# Altium schematic sheet controller.SchDoc
size A3; SheetNumber: 4; SheetTotal: 5
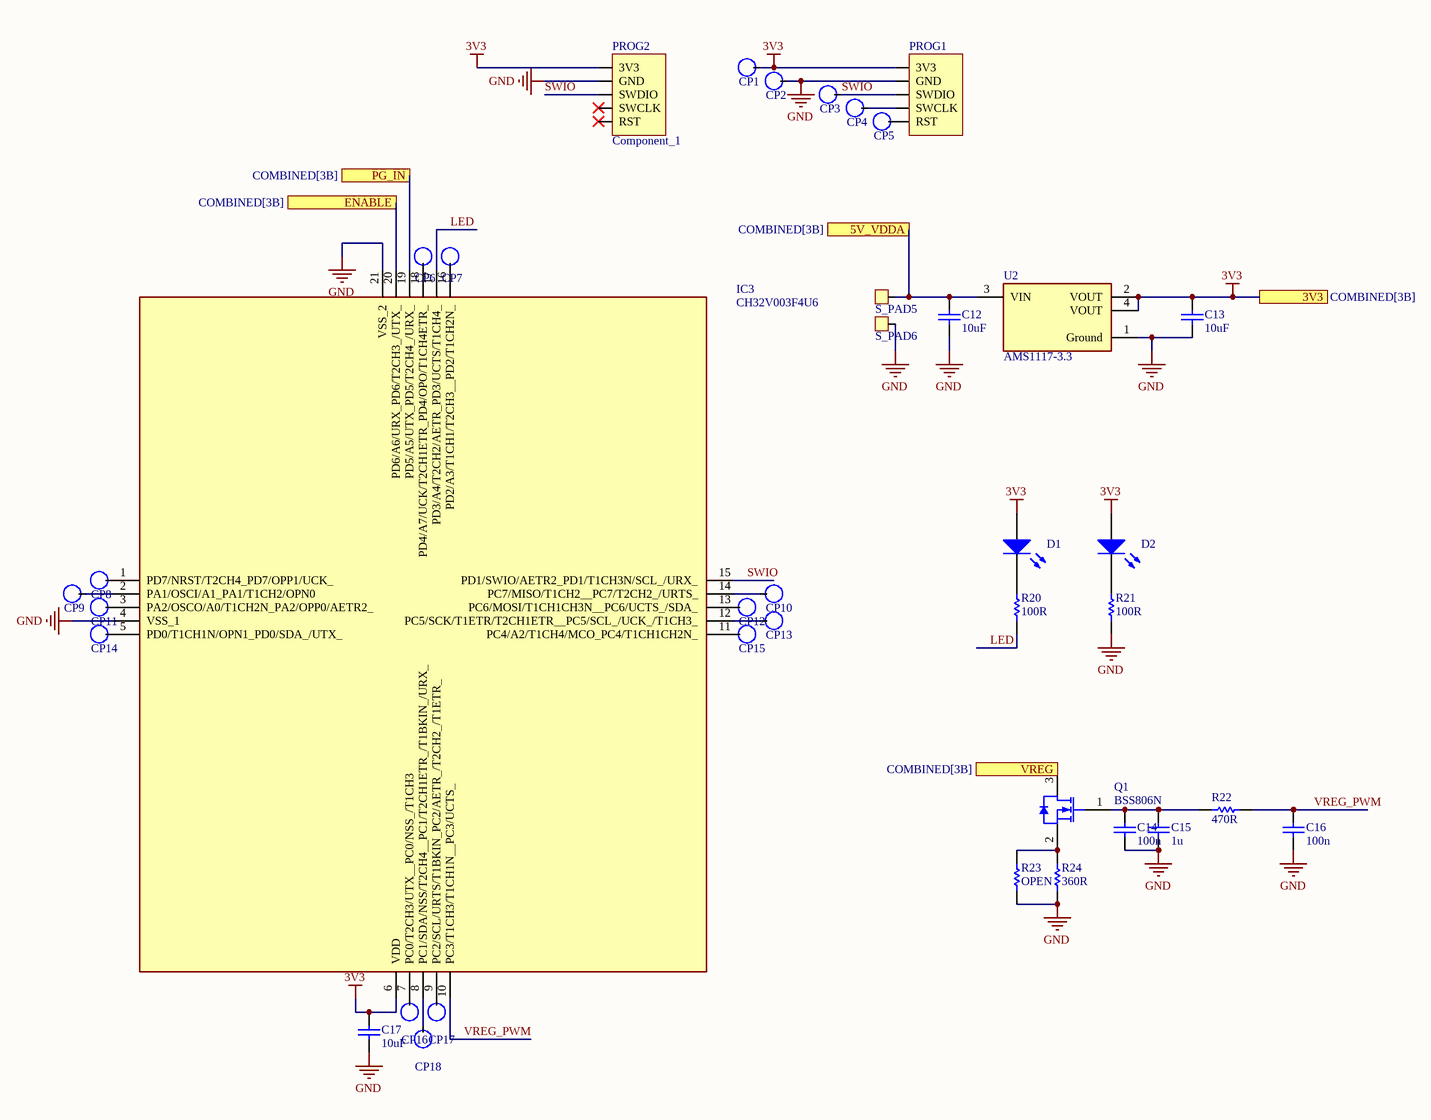
[diagram p0: controller.SchDoc]

## Parts
C12  value 10uF  [SMD-0603-RES]  (hidden comment: Capacitor)
C13  value 10uF  [SMD-0603-RES]  (hidden comment: Capacitor)
C14  value 100n  [CAP FILM 0603_1608]  (hidden comment: Capacitor)
C15  value 1u  [CAP FILM 0603_1608]  (hidden comment: Capacitor)
C16  value 100n  [CAP FILM 0603_1608]  (hidden comment: Capacitor)
C17  value 10uF  [SMD-0603-RES]  (hidden comment: Capacitor)
CP1  CONNECT_PAD  [PAD_SQUARE]  (value not drawn)
CP2  CONNECT_PAD  [PAD_SQUARE]  (value not drawn)
CP3  CONNECT_PAD  [PAD_SQUARE]  (value not drawn)
CP4  CONNECT_PAD  [PAD_SQUARE]  (value not drawn)
CP5  CONNECT_PAD  [PAD_SQUARE]  (value not drawn)
CP6  CONNECT_PAD  [PAD_SQUARE]  (value not drawn)
CP7  CONNECT_PAD  [PAD_SQUARE]  (value not drawn)
CP8  CONNECT_PAD  [PAD_SQUARE]  (value not drawn)
CP9  CONNECT_PAD  [PAD_SQUARE]  (value not drawn)
CP10  CONNECT_PAD  [PAD_SQUARE]  (value not drawn)
CP11  CONNECT_PAD  [PAD_SQUARE]  (value not drawn)
CP12  CONNECT_PAD  [PAD_SQUARE]  (value not drawn)
CP13  CONNECT_PAD  [PAD_SQUARE]  (value not drawn)
CP14  CONNECT_PAD  [PAD_SQUARE]  (value not drawn)
CP15  CONNECT_PAD  [PAD_SQUARE]  (value not drawn)
CP16  CONNECT_PAD  [PAD_SQUARE]  (value not drawn)
CP17  CONNECT_PAD  [PAD_SQUARE]  (value not drawn)
CP18  CONNECT_PAD  [PAD_SQUARE]  (value not drawn)
D1  Light-Emitting Diode  [SMD-0603-RES]  (value not drawn)
D2  Light-Emitting Diode  [SMD-0603-RES]  (value not drawn)
IC3  CH32V003F4U6  [QFN40P300X300X80-21N-D]
PROG1  Component_1  [programming_pad]  (value not drawn)
PROG2  Component_1  [programming_pad]
Q1  BSS806N  [INF-PG-SOT23_N]
R20  value 100R  [SMD-0603-RES]  (hidden comment: Resistor)
R21  value 100R  [SMD-0603-RES]  (hidden comment: Resistor)
R22  value 470R  [RES 0603_1608]  (hidden comment: Resistor)
R23  value OPEN  [RES 0603_1608]  (hidden comment: Resistor)
R24  value 360R  [RES 0603_1608]  (hidden comment: Resistor)
S_PAD5  SOLDER_PAD  [PAD_SQUARE]  (value not drawn)
S_PAD6  SOLDER_PAD  [PAD_SQUARE]  (value not drawn)
U2  AMS1117-3.3  [FP-AMS1117-IPC_C]

## Ports
3V3 (see COMBINED[3B]), 5V_VDDA (see COMBINED[3B]), ENABLE (see COMBINED[3B]), PG_IN (see COMBINED[3B]), VREG (see COMBINED[3B])

## Nets
3V3: C13.2 C17.2 CP1.1 D1.1(A) D2.1(A) IC3.6(VDD) PROG1.1(3V3) PROG2.1(3V3) U2.2(VOUT) U2.4(VOUT) ; port 3V3
GND: C12.1 C13.1 C14.1 C15.1 C16.1 C17.1 CP2.1 IC3.4(VSS_1) IC3.21(VSS_2) PROG1.2(GND) PROG2.2(GND) R21.1 R23.1 R24.1 S_PAD6.1 U2.1(Ground)
5V_VDDA: C12.2 S_PAD5.1 U2.3(VIN) ; port 5V_VDDA
ENABLE: IC3.20(PD6/A6/URX_PD6/T2CH3_/UTX_) ; port ENABLE
LED: IC3.17(PD3/A4/T2CH2/AETR_PD3/UCTS/T1CH4_) R20.1
PG_IN: IC3.19(PD5/A5/UTX_PD5/T2CH4_/URX_) ; port PG_IN
SWIO: CP3.1 IC3.15(PD1/SWIO/AETR2_PD1/T1CH3N/SCL_/URX_) PROG1.4(SWDIO) PROG2.4(SWDIO)
VREG: Q1.3(DRAIN) ; port VREG
VREG_PWM: C16.2 IC3.10(PC3/T1CH3/T1CH1N__PC3/UCTS_) R22.2
NetC14_2: C14.2 C15.2 Q1.1(GATE) R22.1
NetCP4_1: CP4.1 PROG1.3(SWCLK)
NetCP5_1: CP5.1 PROG1.5(RST)
NetCP6_1: CP6.1 IC3.18(PD4/A7/UCK/T2CH1ETR_PD4/OPO/T1CH4ETR_)
NetCP7_1: CP7.1 IC3.16(PD2/A3/T1CH1/T2CH3__PD2/T1CH2N_)
NetCP8_1: CP8.1 IC3.1(PD7/NRST/T2CH4_PD7/OPP1/UCK_)
NetCP9_1: CP9.1 IC3.2(PA1/OSCI/A1_PA1/T1CH2/OPN0)
NetCP10_1: CP10.1 IC3.14(PC7/MISO/T1CH2__PC7/T2CH2_/URTS_)
NetCP11_1: CP11.1 IC3.3(PA2/OSCO/A0/T1CH2N_PA2/OPP0/AETR2_)
NetCP12_1: CP12.1 IC3.13(PC6/MOSI/T1CH1CH3N__PC6/UCTS_/SDA_)
NetCP13_1: CP13.1 IC3.12(PC5/SCK/T1ETR/T2CH1ETR__PC5/SCL_/UCK_/T1CH3_)
NetCP14_1: CP14.1 IC3.5(PD0/T1CH1N/OPN1_PD0/SDA_/UTX_)
NetCP15_1: CP15.1 IC3.11(PC4/A2/T1CH4/MCO_PC4/T1CH1CH2N_)
NetCP16_1: CP16.1 IC3.7(PC0/T2CH3/UTX__PC0/NSS_/T1CH3)
NetCP17_1: CP17.1 IC3.9(PC2/SCL/URTS/T1BKIN_PC2/AETR_/T2CH2_/T1ETR_)
NetCP18_1: CP18.1 IC3.8(PC1/SDA/NSS/T2CH4__PC1/T2CH1ETR_/T1BKIN_/URX_)
NetD1_2: D1.2(K) R20.2
NetD2_2: D2.2(K) R21.2
NetQ1_2: Q1.2(SOURCE) R23.2 R24.2

Not connected (* = marked no-connect by the designer): PROG2 3(SWCLK)* 5(RST)*

## Library data of the parts
C12-C17 = Capacitor: SimulationGenericComponent: True
D1 D2 = LED: AF: 1; BV: 0; BV_MAX: 1e99; EG: 1.11; FC: 0.5; IBV: 0.001; IS: 1e-14; MJSW: 0.33; NTUN: 30; TNOM: 27; XTI: 3; SimulationGenericComponent: True; CJO: 0; CJP: 0; CTA: 0; CTP: 0; FCS: 0.5; FV_MAX: 1e99; IKF: 0; IKR: 0; ISR: 1e-14; JSW: 0; JTUN: 0; JTUNSW: 0; KEG: 1; KF: 0; LEVEL: 1; N: 1; NBV: 1; NR: 1; NS: 1; PHP: 1; RS: 0; TCV: 0; TLEV: 0; TLEVC: 0; TM1: 0; TM2: 0; TPB: 0; TPHP: 0; TRS: 0; TRS2: 0; TT: 0; TTT1: 0; TTT2: 0; VJ: 1; XTITUN: 3
IC3 = CH32V003F4U6: Integrated Circuit; Manufacturer_Name: WCH; Datasheet Link: https://www.lcsc.com/datasheet/lcsc_datasheet_2409280202_WCH-Jiangsu-Qin-Heng-CH32V003F4U6_C5299908.pdf; Height: 0.8mm; Manufacturer_Part_Number: CH32V003F4U6
Q1 = CMP-1149-00036-1: N-Channel OptiMOS 2 Small-Signal-Transistor, 20 V VDS, 2.3 A ID, -55 to 150 degC, PG-SOT23, Reel, Green; Manufacturer: Infineon; VDS (max): 20 V; RthJA (max): 250 K/W; VGS(th) (max): 0.75Â V; QG: 1.7Â nC; RDS (on) (max) (@2.5V): 57 mOhm; VGS(th) (min): 0.3Â V; Ptot (max): 0.5Â W; Green: TRUE; IDpuls (max): 9.3Â A; ID (max): 2.3Â A; RDS (on) (max) (@1.8V): 82 mOhm; Halogen-free: TRUE; PackageVersion: Apr-08; PackageReference: PG-SOT23; PackageDescription: 3-Pin Small Outline Transistor Package, 2.9 x 1.3 mm Body, 0.95 mm Pitch; ComponentLink3URL: http://www.infineon.com/dgdl/SOT23-Package_Overview.pdf?folderId=db3a30431936bc4b0119532290053c66&fileId=db3a30431936bc4b0119533468123c85; ComponentLink3Description: Package Specification; ComponentLink2Description: Datasheet; Packing: Reel; Mounting Technology: Surface Mount; PartNumber: BSS806N; RDS (on) (max): 57 mOhm; ComponentLink2URL: http://www.infineon.com/dgdl/BSS806N_Rev2.3_.pdf?folderId=db3a3043156fd573011622e10b5c1f67&fileId=db3a304330f686060131185f0553451c; ComponentLink1URL: http://www.infineon.com/; ComponentLink1Description: Manufacturer URL; DatasheetVersion: Rev. 2.3
R20-R24 = Resistor: TC1: 0; SimulationGenericComponent: True; TC2: 0
U2 = CMP-209535-000001-1: LDO Voltage Regulators 1A, 3.3V; Manufacturer: Advanced Monolithic Systems; Dropout Voltage: 1.1V; Output Type: Fixed; Nominal Supply Current: 5mA; Max Power Dissipation: 1.2W; Max Supply Voltage: 15V; Number Of Outputs: 1; Standoff Height: 0.64mm; Max Junction Temp: +125°C; Height: 1.8mm; Package: AMS1117; Device Class L2: Power Management ICs; ComponentLink2Description: Datasheet; ComponentLink2URL: http://www.advanced-monolithic.com/pdf/ds1117.pdf; Category: IC; RoHS: TRUE; Automotive: No; Device Class L1: Integrated Circuits (ICs); Output Current: 1A; Device Class L3: Voltage Regulators - Linear; Temperature: -40°C to +125°C; Output Voltage: 3.3V; Manufacturer Part Number: AMS1117-3.3; Temperature Range Low: -40°C; Octopart: https://octopart.com/ams1117-3.3-advanced+monolithic+systems-25899300; Lead Free: Yes; Ipc Land Pattern Name: SOT229P700X180-4; Temperature Range High: +125°C